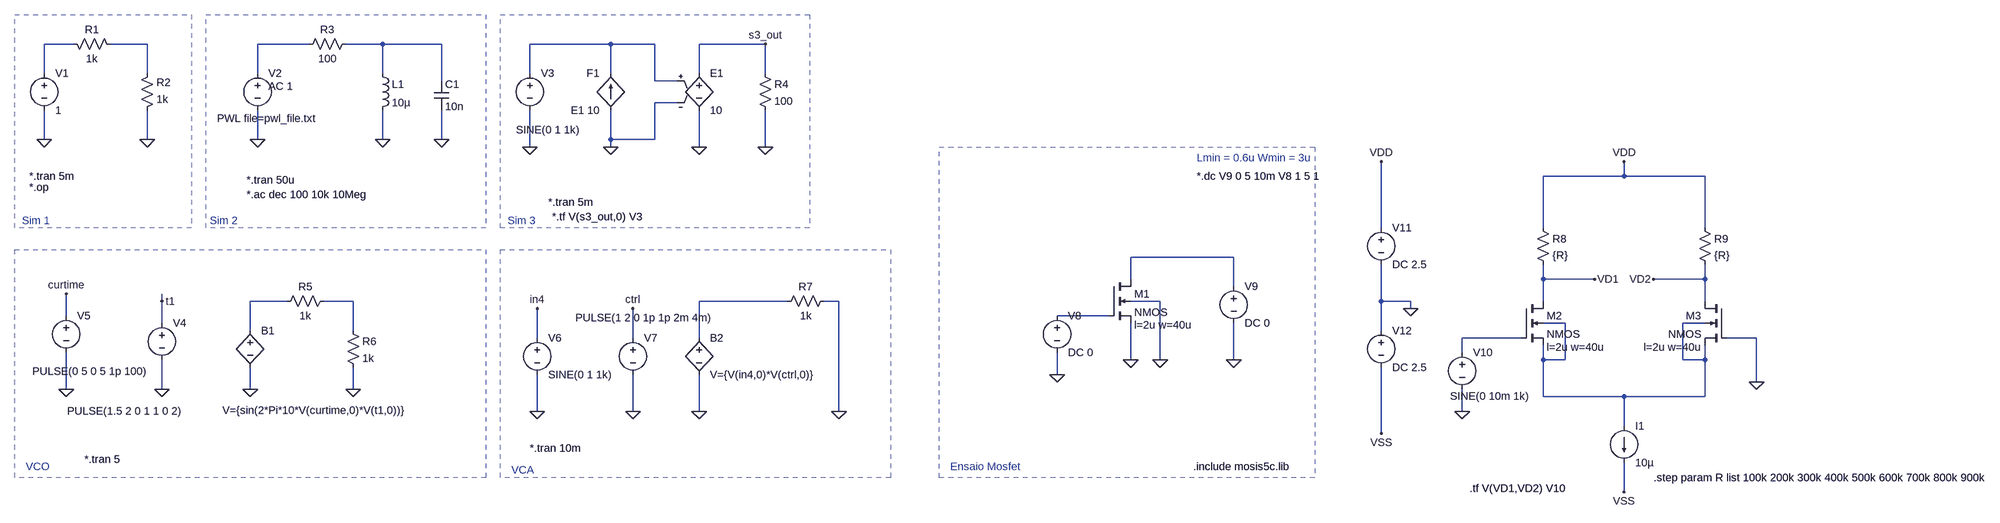
[diagram p0: schematic simulacoes.asc]
simulacoes.asc, the LTspice schematic file:
Version 4
SHEET 1 3104 716
WIRE -1200 -352 -1264 -352
WIRE -1040 -352 -1120 -352
WIRE -688 -352 -800 -352
WIRE -528 -352 -608 -352
WIRE -400 -352 -528 -352
WIRE -32 -352 -208 -352
WIRE 64 -352 -32 -352
WIRE 304 -352 160 -352
WIRE -1264 -288 -1264 -352
WIRE -1040 -288 -1040 -352
WIRE -800 -288 -800 -352
WIRE -528 -288 -528 -352
WIRE -208 -288 -208 -352
WIRE -32 -288 -32 -352
WIRE 160 -288 160 -352
WIRE 304 -288 304 -352
WIRE -400 -272 -400 -352
WIRE 64 -272 64 -352
WIRE 112 -272 64 -272
WIRE 112 -224 64 -224
WIRE -1264 -144 -1264 -208
WIRE -1040 -144 -1040 -208
WIRE -800 -144 -800 -208
WIRE -528 -144 -528 -208
WIRE -400 -144 -400 -208
WIRE -32 -144 -32 -208
WIRE 64 -144 64 -224
WIRE 64 -144 -32 -144
WIRE -208 -128 -208 -208
WIRE -32 -128 -32 -144
WIRE 160 -128 160 -208
WIRE 304 -128 304 -208
WIRE 2256 -64 2256 -96
WIRE 2256 -64 2080 -64
WIRE 2432 -64 2256 -64
WIRE 1728 48 1728 -96
WIRE 2080 48 2080 -64
WIRE 2432 48 2432 -64
WIRE 1344 112 1120 112
WIRE 1120 160 1120 112
WIRE 2080 160 2080 128
WIRE 2192 160 2080 160
WIRE 2432 160 2432 128
WIRE 2432 160 2320 160
WIRE 1344 176 1344 112
WIRE -1008 208 -1008 192
WIRE -736 208 -816 208
WIRE -592 208 -656 208
WIRE 352 208 160 208
WIRE 464 208 432 208
WIRE 1184 208 1120 208
WIRE 1728 208 1728 128
WIRE 1792 208 1728 208
WIRE 2080 208 2080 160
WIRE 2432 208 2432 160
WIRE 1792 224 1792 208
WIRE -1216 240 -1216 192
WIRE 1072 240 960 240
WIRE -1008 256 -1008 208
WIRE 2128 256 2080 256
WIRE 2432 256 2384 256
WIRE -816 272 -816 208
WIRE -592 272 -592 208
WIRE 1728 272 1728 208
WIRE -192 288 -192 224
WIRE 16 288 16 224
WIRE 160 288 160 208
WIRE 2032 288 1904 288
WIRE 2544 288 2480 288
WIRE 1904 320 1904 288
WIRE 1120 336 1120 256
WIRE 1184 336 1184 208
WIRE 1344 336 1344 256
WIRE 2080 336 2080 304
WIRE 2128 336 2128 256
WIRE 2128 336 2080 336
WIRE 2384 336 2384 256
WIRE 2432 336 2432 304
WIRE 2432 336 2384 336
WIRE 960 368 960 320
WIRE 2544 384 2544 288
WIRE -1216 400 -1216 320
WIRE -1008 400 -1008 336
WIRE -816 400 -816 352
WIRE -592 400 -592 352
WIRE 2080 416 2080 336
WIRE 2256 416 2080 416
WIRE 2432 416 2432 336
WIRE 2432 416 2256 416
WIRE -192 448 -192 368
WIRE 16 448 16 368
WIRE 160 448 160 368
WIRE 464 448 464 208
WIRE 1904 448 1904 400
WIRE 2256 480 2256 416
WIRE 1728 496 1728 352
WIRE 2256 624 2256 560
FLAG -1264 -144 0
FLAG -1040 -144 0
FLAG -528 -144 0
FLAG -400 -144 0
FLAG -800 -144 0
FLAG -32 -128 0
FLAG 160 -128 0
FLAG -208 -128 0
FLAG 304 -128 0
FLAG 304 -352 s3_out
FLAG -592 400 0
FLAG -816 400 0
FLAG -1008 400 0
FLAG -1008 208 t1
FLAG -1216 400 0
FLAG -1216 192 curtime
FLAG -192 448 0
FLAG -192 224 in4
FLAG 16 448 0
FLAG 16 224 ctrl
FLAG 160 448 0
FLAG 464 448 0
FLAG 1120 336 0
FLAG 1184 336 0
FLAG 960 368 0
FLAG 1344 336 0
FLAG 2544 384 0
FLAG 1792 224 0
FLAG 1728 -96 VDD
FLAG 1728 496 VSS
FLAG 2256 624 VSS
FLAG 1904 448 0
FLAG 2256 -96 VDD
FLAG 2192 160 VD1
FLAG 2320 160 VD2
DATAFLAG -1264 -352 ""
DATAFLAG -1040 -352 ""
SYMBOL voltage -1264 -304 R0
WINDOW 123 0 0 Left 0
WINDOW 39 0 0 Left 0
SYMATTR InstName V1
SYMATTR Value 1
SYMBOL res -1216 -368 M90
WINDOW 0 0 56 VBottom 2
WINDOW 3 32 56 VTop 2
SYMATTR InstName R1
SYMATTR Value 1k
SYMBOL res -1056 -192 M180
WINDOW 0 36 76 Left 2
WINDOW 3 36 40 Left 2
SYMATTR InstName R2
SYMATTR Value 1k
SYMBOL voltage -800 -304 R0
WINDOW 3 -88 114 Left 2
WINDOW 123 24 44 Left 2
WINDOW 39 0 0 Left 0
SYMATTR Value PWL file=pwl_file.txt
SYMATTR Value2 AC 1
SYMATTR InstName V2
SYMBOL res -592 -368 R90
WINDOW 0 0 56 VBottom 2
WINDOW 3 32 56 VTop 2
SYMATTR InstName R3
SYMATTR Value 100
SYMBOL ind -544 -304 R0
SYMATTR InstName L1
SYMATTR Value 10µ
SYMBOL cap -416 -272 R0
SYMATTR InstName C1
SYMATTR Value 10n
SYMBOL e 160 -304 R0
SYMATTR InstName E1
SYMATTR Value 10
SYMBOL f -32 -208 R180
WINDOW 0 24 80 Left 2
WINDOW 3 24 0 Left 2
SYMATTR InstName F1
SYMATTR Value E1 10
SYMBOL voltage -208 -304 R0
WINDOW 3 -30 139 Left 2
WINDOW 123 0 0 Left 0
WINDOW 39 0 0 Left 0
SYMATTR Value SINE(0 1 1k)
SYMATTR InstName V3
SYMBOL res 288 -304 R0
SYMATTR InstName R4
SYMATTR Value 100
SYMBOL bv -816 256 R0
WINDOW 3 -60 190 Left 2
SYMATTR Value V={sin(2*Pi*10*V(curtime,0)*V(t1,0))}
SYMATTR InstName B1
SYMBOL res -640 192 R90
WINDOW 0 0 56 VBottom 2
WINDOW 3 32 56 VTop 2
SYMATTR InstName R5
SYMATTR Value 1k
SYMBOL res -608 256 R0
SYMATTR InstName R6
SYMATTR Value 1k
SYMBOL voltage -1008 240 R0
WINDOW 3 -206 207 Left 2
WINDOW 123 0 0 Left 0
WINDOW 39 0 0 Left 0
SYMATTR Value PULSE(1.5 2 0 1 1 0 2)
SYMATTR InstName V4
SYMBOL voltage -1216 224 R0
WINDOW 3 -74 137 Left 2
WINDOW 123 0 0 Left 0
WINDOW 39 0 0 Left 0
SYMATTR Value PULSE(0 5 0 5 1p 100)
SYMATTR InstName V5
SYMBOL voltage -192 272 R0
WINDOW 123 0 0 Left 0
WINDOW 39 0 0 Left 0
SYMATTR InstName V6
SYMATTR Value SINE(0 1 1k)
SYMBOL bv 160 272 R0
SYMATTR InstName B2
SYMATTR Value V={V(in4,0)*V(ctrl,0)}
SYMBOL voltage 16 272 R0
WINDOW 3 -125 -28 Left 2
WINDOW 123 0 0 Left 0
WINDOW 39 0 0 Left 0
SYMATTR Value PULSE(1 2 0 1p 1p 2m 4m)
SYMATTR InstName V7
SYMBOL res 448 192 R90
WINDOW 0 0 56 VBottom 2
WINDOW 3 32 56 VTop 2
SYMATTR InstName R7
SYMATTR Value 1k
SYMBOL nmos4 1072 160 R0
WINDOW 123 56 100 Left 2
SYMATTR Value2 l=2u w=40u
SYMATTR InstName M1
SYMBOL voltage 960 224 R0
SYMATTR InstName V8
SYMATTR Value DC 0
SYMBOL voltage 1344 160 R0
SYMATTR InstName V9
SYMATTR Value DC 0
SYMBOL nmos4 2032 208 R0
WINDOW 123 56 100 Left 2
SYMATTR Value2 l=2u w=40u
SYMATTR InstName M2
SYMBOL nmos4 2480 208 M0
WINDOW 123 56 100 Left 2
SYMATTR Value2 l=2u w=40u
SYMATTR InstName M3
SYMBOL current 2256 480 R0
SYMATTR InstName I1
SYMATTR Value 10µ
SYMBOL voltage 1904 304 R0
WINDOW 3 -26 111 Left 2
WINDOW 123 0 0 Left 0
WINDOW 39 0 0 Left 0
SYMATTR Value SINE(0 10m 1k)
SYMATTR InstName V10
SYMBOL voltage 1728 32 R0
SYMATTR InstName V11
SYMATTR Value DC 2.5
SYMBOL voltage 1728 256 R0
SYMATTR InstName V12
SYMATTR Value DC 2.5
SYMBOL res 2064 32 R0
SYMATTR InstName R8
SYMATTR Value {R}
SYMBOL res 2416 32 R0
SYMATTR InstName R9
SYMATTR Value {R}
TEXT -1312 32 Left 2 ;Sim 1
TEXT -1296 -64 Left 2 !*.tran 5m
TEXT -1296 -40 Left 2 !*.op
TEXT -824 -56 Left 2 !*.tran 50u
TEXT -824 -24 Left 2 !*.ac dec 100 10k 10Meg
TEXT -904 32 Left 2 ;Sim 2
TEXT -168 -8 Left 2 !*.tran 5m
TEXT -160 24 Left 2 !*.tf V(s3_out,0) V3
TEXT -256 32 Left 2 ;Sim 3
TEXT -1176 552 Left 2 !*.tran 5
TEXT -1304 568 Left 2 ;VCO
TEXT -208 528 Left 2 !*.tran 10m
TEXT -248 576 Left 2 ;VCA
TEXT 1256 568 Left 2 !.include mosis5c.lib
TEXT 728 568 Left 2 ;Ensaio Mosfet
TEXT 1264 -104 Left 2 ;Lmin = 0.6u Wmin = 3u
TEXT 1264 -64 Left 2 !*.dc V9 0 5 10m V8 1 5 1
TEXT 1920 616 Left 2 !.tf V(VD1,VD2) V10
TEXT 2320 592 Left 2 !.step param R list 100k 200k 300k 400k 500k 600k 700k 800k 900k
RECTANGLE Normal -944 48 -1328 -416 2
RECTANGLE Normal -304 48 -912 -416 2
RECTANGLE Normal 400 48 -272 -416 2
RECTANGLE Normal -304 592 -1328 96 2
RECTANGLE Normal 576 592 -272 96 2
RECTANGLE Normal 1520 592 704 -128 2

The netlist it stands for:
* simulacoes.asc
V1 N001 0 1
R1 N001 N002 1k
R2 0 N002 1k
V2 N003 0 PWL file=pwl_file.txt AC 1
R3 N004 N003 100
L1 N004 0 10µ
C1 N004 0 10n
E1 s3_out 0 N005 0 10
F1 0 N005 E1 10
V3 N005 0 SINE(0 1 1k)
R4 s3_out 0 100
B1 N007 0 V={sin(2*Pi*10*V(curtime,0)*V(t1,0))}
R5 N008 N007 1k
R6 N008 0 1k
V4 t1 0 PULSE(1.5 2 0 1 1 0 2)
V5 curtime 0 PULSE(0 5 0 5 1p 100)
V6 in4 0 SINE(0 1 1k)
B2 N009 0 V={V(in4,0)*V(ctrl,0)}
V7 ctrl 0 PULSE(1 2 0 1p 1p 2m 4m)
R7 0 N009 1k
M1 N006 N010 0 0 NMOS l=2u w=40u
V8 N010 0 DC 0
V9 N006 0 DC 0
M2 VD1 N012 N011 N011 NMOS l=2u w=40u
M3 VD2 0 N011 N011 NMOS l=2u w=40u
I1 N011 VSS 10µ
V10 N012 0 SINE(0 10m 1k)
V11 VDD 0 DC 2.5
V12 0 VSS DC 2.5
R8 VDD VD1 {R}
R9 VDD VD2 {R}
.model NMOS NMOS
.model PMOS PMOS
.lib standard.mos
* Sim 1
*.tran 5m
*.op
*.tran 50u
*.ac dec 100 10k 10Meg
* Sim 2
*.tran 5m
*.tf V(s3_out,0) V3
* Sim 3
*.tran 5
* VCO
*.tran 10m
* VCA
.include mosis5c.lib
* Ensaio Mosfet
* Lmin = 0.6u Wmin = 3u
*.dc V9 0 5 10m V8 1 5 1
.tf V(VD1,VD2) V10
.step param R list 100k 200k 300k 400k 500k 600k 700k 800k 900k
.backanno
.end